# EAGLE board csa_cpu_v2.0j (EAGLE 4.15)
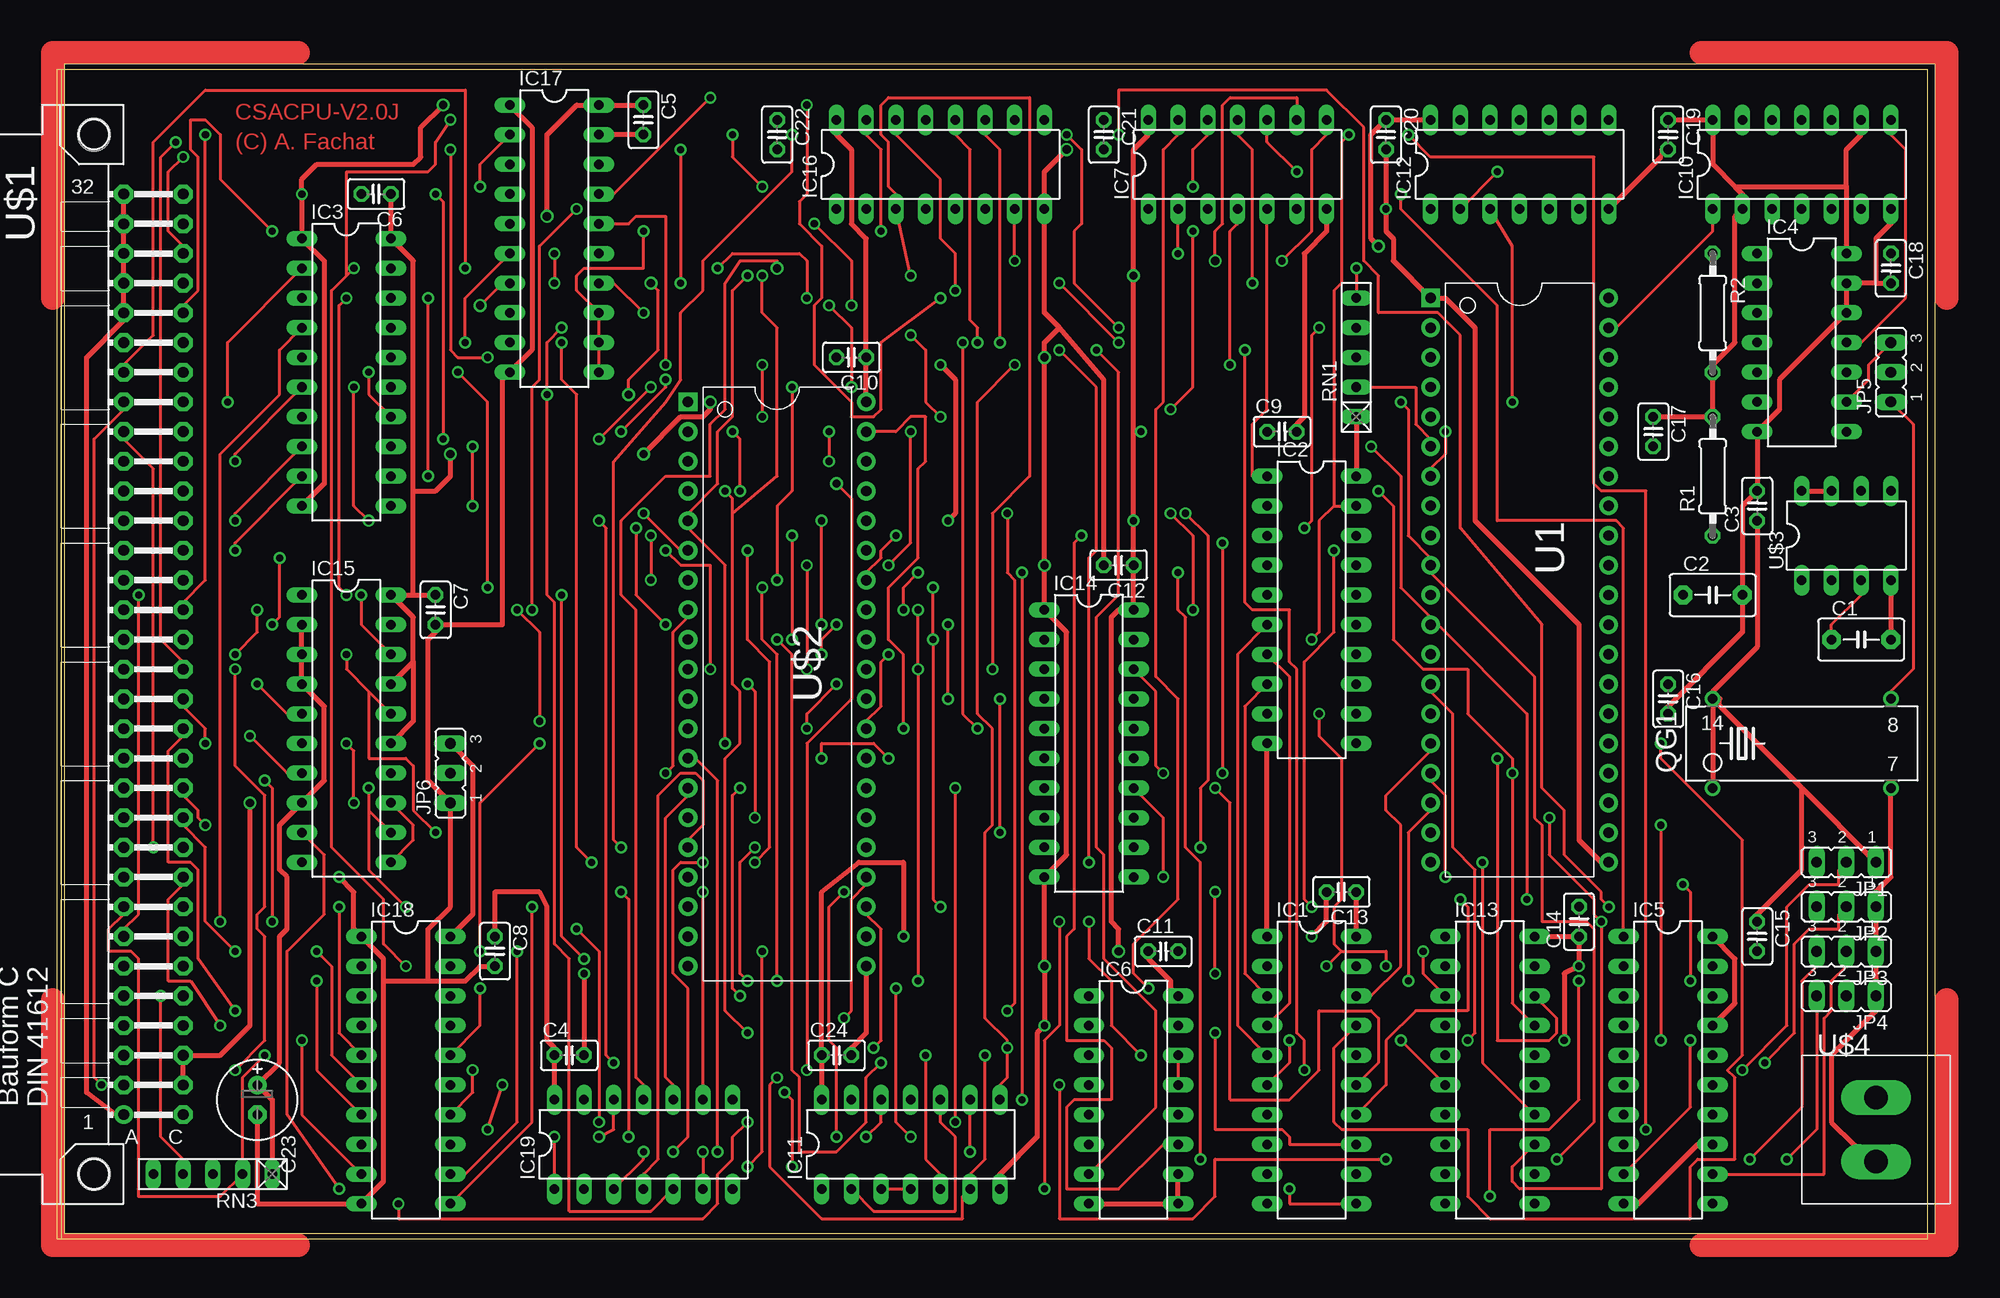
[diagram p2: board, top side]
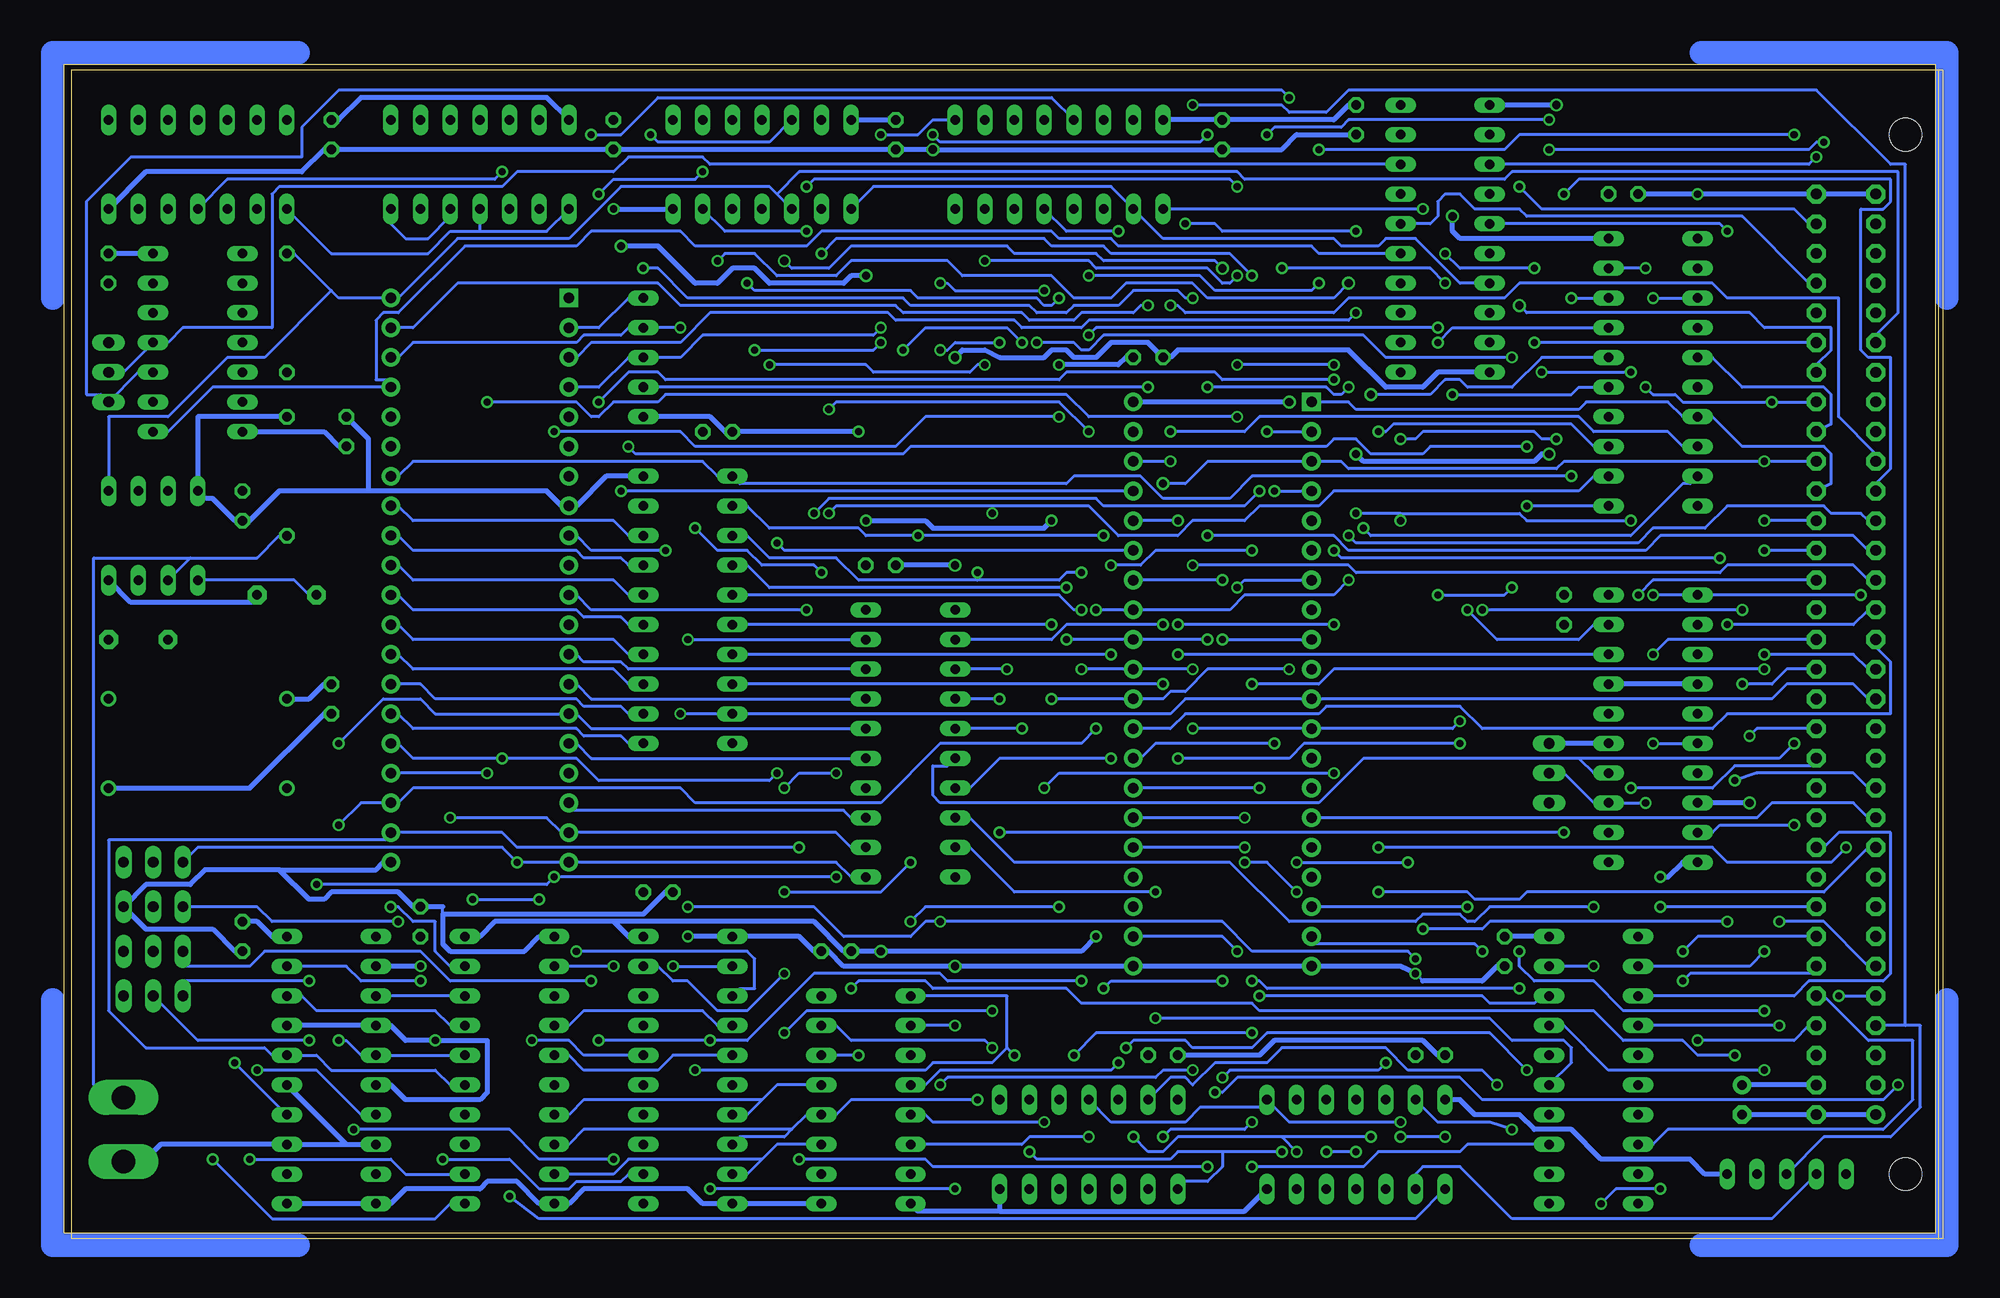
[diagram p3: board, bottom side, seen from below]

Size 160.63 x 100.48 mm. Coordinates in mm from the lower left corner, seen from the top.
Outline: 0,0.01 160,0.01 160,100.01 0,100.01 0,0.01
Outline: 0.63,0.48 160.63,0.48 160.63,100.48 0.63,100.48 0.63,0.48
Copper layers (1*16): Top 0.035mm / dielectric 1.5mm / Bottom 0.035mm
Design rules "default": minimum track width 10mil, minimum drill 24mil, track to track 8mil, track to pad 8mil, pad to pad 8mil, via to via 8mil, smd to smd 8mil, copper to edge 40mil, drill to drill 8mil, minimum pad ring 10mil, minimum via ring 8mil, stop-mask expansion 4mil, vias tented up to drill 0mil, thermal gap 10mil

## Footprints (pad centres in the part's own frame; a part is rotated, then mirrored left to right if it is on the bottom)
C5B3.5 = drill 0.813 pad 1.6 octagon: 1 -2.54,0; 2 2.54,0
C025-025X050 = drill 0.813 octagon: 1 -1.27,0; 2 1.27,0
E2,5-7 = drill 0.813 pad 1.6 round: + -1.27,0 | drill 0.813 pad 1.6 octagon: - 1.27,0
DIL20 = drill 0.813 long: 1 -11.43,-3.81; 2 -8.89,-3.81; 3 -6.35,-3.81; 4 -3.81,-3.81; 5 -1.27,-3.81; 6 1.27,-3.81; 7 3.81,-3.81; 8 6.35,-3.81; 9 8.89,-3.81; 10 11.43,-3.81; 11 11.43,3.81; 12 8.89,3.81; 13 6.35,3.81; 14 3.81,3.81; 15 1.27,3.81; 16 -1.27,3.81; 17 -3.81,3.81; 18 -6.35,3.81; 19 -8.89,3.81; 20 -11.43,3.81
DIL14 = drill 0.813 long: 1 -7.62,-3.81; 2 -5.08,-3.81; 3 -2.54,-3.81; 4 0,-3.81; 5 2.54,-3.81; 6 5.08,-3.81; 7 7.62,-3.81; 8 7.62,3.81; 9 5.08,3.81; 10 2.54,3.81; 11 0,3.81; 12 -2.54,3.81; 13 -5.08,3.81; 14 -7.62,3.81
DIL16 = drill 0.813 long: 1 -8.89,-3.81; 2 -6.35,-3.81; 3 -3.81,-3.81; 4 -1.27,-3.81; 5 1.27,-3.81; 6 3.81,-3.81; 7 6.35,-3.81; 8 8.89,-3.81; 9 8.89,3.81; 10 6.35,3.81; 11 3.81,3.81; 12 1.27,3.81; 13 -1.27,3.81; 14 -3.81,3.81; 15 -6.35,3.81; 16 -8.89,3.81
JP2 = drill 0.914 long: 1 -2.54,0; 2 0,0; 3 2.54,0
SG51 = drill 0.813 round: 1 -7.62,-3.81; 7 7.62,-3.81; 8 7.62,3.81; 14 -7.62,3.81
0207/10 = drill 0.813 octagon: 1 -5.08,0; 2 5.08,0
RN-5 = drill 0.813 long: 1 -5.08,0; 2 -2.54,0; 3 0,0; 4 2.54,0; 5 5.08,0
DIP-40 = drill 0.889 pad 1.6 square: 1 -22.86,-7.62 | drill 0.889 pad 1.6 round: 2 -20.32,-7.62; 3 -17.78,-7.62; 4 -15.24,-7.62; 5 -12.7,-7.62; 6 -10.16,-7.62; 7 -7.62,-7.62; 8 -5.08,-7.62; 9 -2.54,-7.62; 10 0,-7.62; 11 2.54,-7.62; 12 5.08,-7.62; 13 7.62,-7.62; 14 10.16,-7.62; 15 12.7,-7.62; 16 15.24,-7.62; 17 17.78,-7.62; 18 20.32,-7.62; 19 22.86,-7.62; 20 25.4,-7.62; 21 25.4,7.62; 22 22.86,7.62; 23 20.32,7.62; 24 17.78,7.62; 25 15.24,7.62; 26 12.7,7.62; 27 10.16,7.62; 28 7.62,7.62; 29 5.08,7.62; 30 2.54,7.62; 31 0,7.62; 32 -2.54,7.62; 33 -5.08,7.62; 34 -7.62,7.62; 35 -10.16,7.62; 36 -12.7,7.62; 37 -15.24,7.62; 38 -17.78,7.62; 39 -20.32,7.62; 40 -22.86,7.62
CSABUS = drill 0.914 pad 1.6 round: A1 7.62,36.83 | drill 0.914 pad 1.6 octagon: A2 7.62,34.29; A3 7.62,31.75; A4 7.62,29.21; A5 7.62,26.67; A6 7.62,24.13; A7 7.62,21.59; A8 7.62,19.05; A9 7.62,16.51; A10 7.62,13.97; A11 7.62,11.43; A12 7.62,8.89; A13 7.62,6.35; A14 7.62,3.81; A15 7.62,1.27; A16 7.62,-1.27; A17 7.62,-3.81; A18 7.62,-6.35; A19 7.62,-8.89; A20 7.62,-11.43; A21 7.62,-13.97; A22 7.62,-16.51; A23 7.62,-19.05; A24 7.62,-21.59; A25 7.62,-24.13; A26 7.62,-26.67; A27 7.62,-29.21; A28 7.62,-31.75; A29 7.62,-34.29; A30 7.62,-36.83; A31 7.62,-39.37; A32 7.62,-41.91; C1 2.54,36.83; C2 2.54,34.29; C3 2.54,31.75; C4 2.54,29.21; C5 2.54,26.67; C6 2.54,24.13; C7 2.54,21.59; C8 2.54,19.05; C9 2.54,16.51; C10 2.54,13.97; C11 2.54,11.43; C12 2.54,8.89; C13 2.54,6.35; C14 2.54,3.81; C15 2.54,1.27; C16 2.54,-1.27; C17 2.54,-3.81; C18 2.54,-6.35; C19 2.54,-8.89; C20 2.54,-11.43; C21 2.54,-13.97; C22 2.54,-16.51; C23 2.54,-19.05; C24 2.54,-21.59; C25 2.54,-24.13; C26 2.54,-26.67; C27 2.54,-29.21; C28 2.54,-31.75; C29 2.54,-34.29; C30 2.54,-36.83; C31 2.54,-39.37; C32 2.54,-41.91 | hole 2.794: 10.16,41.91; 10.16,-46.99
DIP40 = drill 0.889 pad 1.6 square: 1 -24.13,-7.62 | drill 0.889 pad 1.6 round: 2 -21.59,-7.62; 3 -19.05,-7.62; 4 -16.51,-7.62; 5 -13.97,-7.62; 6 -11.43,-7.62; 7 -8.89,-7.62; 8 -6.35,-7.62; 9 -3.81,-7.62; 10 -1.27,-7.62; 11 1.27,-7.62; 12 3.81,-7.62; 13 6.35,-7.62; 14 8.89,-7.62; 15 11.43,-7.62; 16 13.97,-7.62; 17 16.51,-7.62; 18 19.05,-7.62; 19 21.59,-7.62; 20 24.13,-7.62; 21 24.13,7.62; 22 21.59,7.62; 23 19.05,7.62; 24 16.51,7.62; 25 13.97,7.62; 26 11.43,7.62; 27 8.89,7.62; 28 6.35,7.62; 29 3.81,7.62; 30 1.27,7.62; 31 -1.27,7.62; 32 -3.81,7.62; 33 -6.35,7.62; 34 -8.89,7.62; 35 -11.43,7.62; 36 -13.97,7.62; 37 -16.51,7.62; 38 -19.05,7.62; 39 -21.59,7.62; 40 -24.13,7.62
DIL08@1 = drill 0.813 long: 1 -11.43,-2.54; 2 -8.89,-2.54; 3 -6.35,-2.54; 4 -3.81,-2.54; 5 -3.81,5.08; 6 -6.35,5.08; 7 -8.89,5.08; 8 -11.43,5.08
TASTER = drill 2.007 long: 1 0,4.013; 3 0,-1.473

## Placement (x,y rotation side)
C1  100n  [C5B3.5]  154.3,51.28 0 top
C2  100n  [C5B3.5]  141.6,55.09 0 top
C3  100n  [C025-025X050]  145.41,62.71 90 top
C4  100n  [C025-025X050]  43.81,15.72 0 top
C5  100n  [C025-025X050]  50.16,95.73 270 top
C6  100n  [C025-025X050]  27.3,89.38 180 top
C7  100n  [C025-025X050]  32.38,53.82 270 top
C8  100n  [C025-025X050]  37.46,24.61 270 top
C9  100n  [C025-025X050]  104.77,69.06 0 top
C10  100n  [C025-025X050]  67.94,75.41 180 top
C11  100n  [C025-025X050]  94.61,24.61 0 top
C12  100n  [C025-025X050]  90.8,57.63 180 top
C13  100n  [C025-025X050]  109.85,29.69 180 top
C14  100n  [C025-025X050]  130.17,27.15 90 top
C15  100n  [C025-025X050]  145.41,25.88 270 top
C16  100n  [C025-025X050]  137.79,46.2 270 top
C17  100n  [C025-025X050]  136.52,69.06 270 top
C18  100n  [C025-025X050]  156.84,83.03 270 top
C19  100n  [C025-025X050]  137.79,94.46 270 top
C20  100n  [C025-025X050]  113.66,94.46 270 top
C21  100n  [C025-025X050]  89.53,94.46 270 top
C22  100n  [C025-025X050]  61.59,94.46 270 top
C23  47u  [E2,5-7]  17.14,11.91 270 top
C24  100n  [C025-025X050]  66.67,15.72 0 top
IC1  74LS245N  [DIL20]  107.31,14.45 270 top
IC2  74LS245N  [DIL20]  107.31,53.82 270 top
IC3  74LS245N  [DIL20]  24.76,74.14 270 top
IC4  74LS293N  [DIL14]  149.22,76.68 270 top
IC5  74LS688N  [DIL20]  137.79,14.45 270 top
IC6  74LS173N  [DIL16]  92.07,11.91 270 top
IC7  74LS14N  [DIL14]  100.96,91.92 0 top
IC10  74LS164N  [DIL14]  149.22,91.92 0 top
IC11  74LS02N  [DIL14]  73.02,8.1 0 top
IC12  74LS86N  [DIL14]  125.09,91.92 0 top
IC13  74LS245N  [DIL20]  122.55,14.45 270 top
IC14  74LS245N  [DIL20]  88.26,42.39 270 top
IC15  74LS688N  [DIL20]  24.76,43.66 270 top
IC16  74LS139N  [DIL16]  75.56,91.92 0 top
IC17  74LS245N  [DIL20]  42.54,85.57 270 top
IC18  74LS245N  [DIL20]  29.84,14.45 270 top
IC19  74ALS08N  [DIL14]  50.16,8.1 0 top
JP1  [JP2]  153.03,32.23 180 top
JP2  [JP2]  153.03,28.42 180 top
JP3  [JP2]  153.03,24.61 180 top
JP4  [JP2]  153.03,20.8 180 top
JP5  [JP2]  156.84,74.14 90 top
JP6  [JP2]  33.65,39.85 90 top
QG1  16MHz  [SG51]  149.22,42.39 0 top
R1  10k  [0207/10]  141.6,65.25 90 top
R2  4k7  [0207/10]  141.6,79.22 270 top
RN1  4k7  [RN-5]  111.12,75.41 90 top
RN3  4k7  [RN-5]  13.33,5.56 180 top
U1  [DIP-40]  125.09,57.63 270 top
U$1  CSABUS  [CSABUS]  13.33,47.47 180 top
U$2  LS610SMALLPADS  [DIP40]  61.59,47.47 270 top
U$3  TL7705  [DIL08@1]  160.65,58.9 0 top
U$4  TASTER  [TASTER]  155.57,8.1 0 top

## Tracks (layer width: path | path; a pad name or v marks a point on that pad's centre or on a via)
8PHI2
  Top 0.254: IC10.8 156.84,94.46 158.11,93.19 158.11,80.49 154.3,76.68 IC4.11
  Bottom 0.254: IC17.18 105.41,91.92 106.04,92.56 112.39,92.56 113.66,91.29 121.91,91.29 123.19,90.02 142.23,90.02 142.87,89.38 142.87,77.95 150.49,77.95 151.76,76.68 IC4.11 155.57,74.14 JP5.2
16M  (via drill 0.61)
  Top 0.254: v55.88,97.64 47.62,89.38 IC17.17 | QG1.8 156.84,46.84 158.75,48.74 158.75,69.7 JP5.1
  Bottom 0.254: v55.88,97.64 56.51,98.27 137.16,98.27 140.33,95.1 140.33,92.56 154.94,92.56 158.75,88.75 158.75,72.24 157.47,72.24 JP5.1 154.3,74.14 IC4.10
/BE  (via drill 0.61)
  Top 0.254: U$1.A8 5.71,27.79 4.44,26.52 4.44,24.61 6.34,24.61 6.98,23.98 6.98,3.66 13.97,3.66 RN3.2 15.87,13.82 v17.77,15.72 | v93.34,21.44 92.07,22.71 92.07,25.25 95.88,29.06 95.88,46.2 93.97,48.11 93.97,70.97 94.61,71.6 94.61,93.19 95.88,94.46 IC7.13
  Bottom 0.254: v93.34,21.44 92.7,22.07 86.99,22.07 86.35,21.44 74.92,21.44 73.66,20.17 59.05,20.17 58.41,19.53 29.84,19.53 27.3,16.99 22.22,16.99 20.95,15.72 v17.77,15.72
/BEXTIO  (via drill 0.61)
  Top 0.254: v8.89,20.8 8.89,8.74 10.79,6.83 RN3.4
  Bottom 0.254: v8.89,20.8 U$1.A5 | RN3.4 14.6,1.75 31.11,1.75 36.83,1.75 41.27,6.2 44.45,6.2 45.08,5.56 IC19.2
/BIOINH  (via drill 0.61)
  Top 0.254: v102.23,81.76 102.23,93.19 100.96,94.46 IC7.11 | v75.56,80.49 70.48,76.68 70.48,70.97 69.84,70.33 67.94,70.33 67.94,71.6 64.77,74.78 64.77,79.86 65.4,80.49 65.4,84.94 63.5,86.84 63.5,88.75 64.13,89.38 v64.13,97
  Bottom 0.254: 3.17,18.26 1.9,18.26 1.9,11.28 4.44,8.74 10.16,8.74 RN3.3 | 3.17,18.26 U$1.A4 | v102.23,81.76 101.59,81.13 88.26,81.13 87.62,80.49 77.46,80.49 76.83,79.86 76.19,79.86 v75.56,80.49 | v64.13,97 56.51,97 55.88,96.37 52.7,96.37 50.8,98.27 10.79,98.27 4.44,91.92 3.17,91.92 3.17,18.26
/BIOSEL  (via drill 0.61)
  Top 0.254: v6.98,55.09 6.98,27.79 5.71,26.52 U$1.A7 | v24.76,80.49 24.12,79.86 24.12,55.73 v24.76,55.09
  Bottom 0.254: v6.98,55.09 IC15.1 v24.76,55.09 | v24.76,80.49 IC3.3
/BMEMSEL  (via drill 0.61)
  Top 0.254: v13.97,27.15 13.97,67.16 19.04,72.24 19.04,76.05 IC3.4
  Bottom 0.254: v13.97,27.15 10.16,27.15 6.34,23.34 U$1.A6
/BUSEN  (via drill 0.61)
  Top 0.254: v107.31,51.28 107.94,51.92 107.94,61.44 109.21,62.71 | 109.21,62.71 IC2.19 | v110.48,94.46 109.85,93.83 109.85,81.76 109.21,81.13 109.21,62.71 | v29.84,23.34 27.93,25.25 27.93,29.06 23.49,33.5 23.49,81.13 24.76,82.4 | 24.76,82.4 v25.39,83.03 | v97.15,90.02 97.15,93.19 98.42,94.46 IC7.12 | v60.32,90.02 57.78,92.56 v57.78,94.46 | v33.65,95.73 32.38,93.83 32.38,91.92 31.74,91.29 24.76,91.29 24.76,82.4
  Bottom 0.254: v107.31,51.28 IC14.19 | v110.48,94.46 109.85,93.83 100.32,93.83 IC7.12 | v29.84,23.34 IC18.19 | v25.39,83.03 IC3.19 | v97.15,90.02 96.52,90.65 60.96,90.65 v60.32,90.02 | v57.78,94.46 57.15,95.1 51.43,95.1 50.8,95.73 v33.65,95.73
/IOSEL  (via drill 0.61)
  Top 0.254: v50.16,7.47 50.16,6.83 IC19.3 | v52.7,7.47 53.97,8.74 53.97,21.44 52.7,22.71 52.7,31.6 53.34,32.23 v55.24,32.23 | v45.72,32.23 44.45,33.5 44.45,72.24 43.18,73.51 v43.18,76.68
  Bottom 0.254: v50.16,7.47 v52.7,7.47 | v55.24,32.23 v45.72,32.23 | v43.18,76.68 41.91,77.95 IC3.17
/IRQ  (via drill 0.61)
  Top 0.254: v8.25,33.5 8.25,65.89 5.71,68.43 U$1.A24 | v48.26,33.5 47.62,34.14 47.62,66.52 52.07,71.6 53.34,73.51 53.34,79.22 55.24,81.13 55.24,83.67 62.86,91.29 v62.86,94.46 | v86.35,94.46 87.62,93.19 87.62,86.84 86.99,86.21 86.99,81.76 v90.8,77.95
  Bottom 0.254: U1.4 114.93,72.87 112.39,75.41 RN1.3 107.94,75.41 106.04,77.32 91.44,77.32 v90.8,77.95 | v8.25,33.5 9.52,32.23 18.41,32.23 19.68,33.5 v48.26,33.5 | v62.86,94.46 63.5,93.83 85.72,93.83 v86.35,94.46
/MMUCS  (via drill 0.61)
  Top 0.254: v74.29,15.72 74.29,6.83 75.56,5.56 IC11.5 | v59.05,17.63 57.15,19.53 57.15,41.12 58.41,42.39 58.41,46.84 57.78,47.47 57.78,62.08 | 57.78,62.08 57.78,63.35 v57.15,63.98 | v60.32,82.4 60.32,79.22 61.59,77.95 61.59,65.25 57.78,62.08 | v81.91,83.67 IC16.7
  Bottom 0.254: v74.29,15.72 72.38,17.63 v59.05,17.63 | v57.15,63.98 U$2.4 | v81.91,83.67 73.02,83.67 72.38,83.03 62.86,83.03 61.59,81.76 60.96,81.76 v60.32,82.4
/MMUSTROBE  (via drill 0.61)
  Top 0.254: v59.05,82.4 57.78,81.13 57.78,70.33 56.51,69.06 56.51,64.62 53.97,62.08 U$2.5 53.97,60.81 57.15,57.63 v57.15,42.39 | v95.88,84.3 IC7.2
  Bottom 0.254: v95.88,84.3 94.61,85.57 76.83,85.57 76.19,84.94 71.75,84.94 71.11,84.3 60.96,84.3 v59.05,82.4 | v57.15,42.39 67.3,42.39 68.57,41.12 U$2.28
/NMI  (via drill 0.61)
  Top 0.254: RN1.2 116.2,72.87 116.2,69.7 117.47,68.43 U1.6 | v66.03,79.86 67.94,77.95 v67.94,72.87
  Bottom 0.254: v66.03,79.86 65.4,79.86 64.77,79.22 52.07,79.22 50.8,80.49 37.46,80.49 36.19,81.76 19.68,81.76 18.41,80.49 8.89,80.49 8.89,70.33 5.71,67.16 U$1.A23 | v67.94,72.87 RN1.2
/PMEMSEL  (via drill 0.61, 0.7)
  Top 0.254: v104.77,83.67 107.31,86.21 107.31,93.19 108.58,94.46 IC7.8 | v48.89,72.24 48.89,73.51 51.43,76.05 51.43,81.13 v50.8,81.76
  Bottom 0.254: v104.77,83.67 104.13,84.3 101.59,84.3 99.69,82.4 94.61,82.4 93.34,83.67 85.08,83.67 83.81,82.4 76.19,82.4 74.29,80.49 71.11,80.49 69.84,81.76 64.13,81.76 62.86,80.49 52.07,80.49 v50.8,81.76 | IC3.16 34.29,75.41 36.83,72.87 40.64,72.87 41.27,73.51 42.54,73.51 43.81,72.24 v48.89,72.24
/RES
  Bottom 0.254: 99.69,89.38 100.32,90.02 113.02,90.02 117.47,85.57 126.99,85.57 132.07,80.49 U1.40 137.16,80.49 137.79,81.13 | 99.69,89.38 IC7.3 | 137.79,81.13 140.97,84.3 R2.1 | 137.79,81.13 143.5,75.41 146.68,75.41 151.76,70.33 156.84,70.33 U$3.5 | 99.69,89.38 97.78,91.29 60.32,91.29 59.69,90.65 37.46,90.65 36.83,91.29 3.8,91.29 3.8,79.22 5.71,77.32 U$1.A27
/SO  (via drill 0.61)
  Top 0.254: v3.8,13.18 3.17,13.82 3.17,68.43 5.71,70.97 U$1.A25 | v62.23,12.55 62.86,11.91 v62.86,6.2 | v97.78,6.83 97.78,32.23 96.52,33.5 96.52,53.19 95.88,53.82 v95.88,57 | v106.67,60.81 107.31,61.44 107.31,77.32 v107.94,77.95
  Bottom 0.254: U1.38 132.07,75.41 130.81,76.68 116.83,76.68 116.2,77.32 113.02,77.32 112.39,77.95 RN1.4 v107.94,77.95 | v3.8,13.18 5.08,11.91 39.37,11.91 41.27,13.82 60.32,13.82 61.59,12.55 v62.23,12.55 | v62.86,6.2 86.35,6.2 86.99,6.83 v97.78,6.83 | v95.88,57 96.52,57.63 100.96,57.63 102.23,58.9 104.77,58.9 v106.67,60.81
A0  (via drill 0.61)
  Top 0.254: v26.66,74.14 26.66,72.24 IC3.14 | v34.29,74.14 36.83,71.6 v36.83,55.73 | v43.18,55.09 43.18,25.88 v45.08,23.98 | v107.31,28.42 106.67,29.06 106.67,49.38 109.21,51.92 v109.21,58.9 | v105.41,4.29 105.41,3.02 IC1.11 | v84.45,4.29 84.45,16.99 85.72,18.26 v85.72,27.15
  Bottom 0.254: v34.29,74.14 v26.66,74.14 | v36.83,55.73 37.46,55.09 v43.18,55.09 | v45.08,23.98 45.72,24.61 59.05,24.61 61.59,27.15 v85.72,27.15 86.99,27.15 88.26,25.88 93.97,25.88 96.52,28.42 v107.31,28.42 | v109.21,58.9 115.56,58.9 116.83,60.17 U1.9 | v84.45,4.29 v105.41,4.29
A1  (via drill 0.61)
  Top 0.254: v48.26,69.06 52.07,72.87 v52.07,73.51 | v114.93,71.6 115.56,70.97 115.56,60.17 117.47,58.27 U1.10 117.47,57 126.36,48.11 126.36,36.04 126.99,35.41 126.99,27.15 130.81,27.15 131.44,26.52 131.44,10.01 v128.27,6.83
  Bottom 0.254: v48.26,69.06 47.62,69.06 46.98,69.7 31.74,69.7 29.84,67.79 IC3.13 | v52.07,73.51 61.59,73.51 62.23,74.14 74.92,74.14 75.56,73.51 109.21,73.51 109.85,74.14 112.39,74.14 v114.93,71.6 | v128.27,6.83 122.55,6.83 120.01,4.29 117.47,4.29 116.83,4.93 113.02,4.93 112.39,5.56 IC1.12
A2  (via drill 0.61)
  Top 0.254: v95.24,62.08 97.15,60.17 v97.15,53.82 | v99.05,17.63 99.05,9.37 104.77,9.37 105.41,8.74 105.41,8.1 IC1.13 | v81.27,19.53 81.91,20.17 81.91,56.36 81.27,57 v81.27,62.08
  Bottom 0.254: 81.27,62.71 94.61,62.71 v95.24,62.08 | 81.27,62.71 73.02,62.71 70.48,60.17 65.4,60.17 64.13,61.44 59.69,61.44 58.41,62.71 53.34,62.71 52.07,63.98 31.11,63.98 29.84,65.25 IC3.12 | v97.15,53.82 115.56,53.82 116.83,55.09 U1.11 | v99.05,17.63 97.15,19.53 v81.27,19.53 | 81.27,62.71 v81.27,62.08
A3  (via drill 0.61)
  Top 0.254: v35.55,62.71 v35.55,67.79 | v112.39,67.79 114.93,65.25 114.93,55.73 117.47,53.19 U1.12 118.1,52.55 125.72,44.93 v125.72,29.06 | v120.01,29.06 120.64,28.42 120.64,19.53 116.2,19.53 113.66,16.99 113.66,13.18 IC1.14
  Bottom 0.254: v35.55,67.79 43.81,67.79 44.45,67.16 48.89,67.16 50.16,68.43 52.07,68.43 52.7,67.79 88.26,67.79 88.89,67.16 111.75,67.16 v112.39,67.79 | IC3.11 v35.55,62.71 | v125.72,29.06 v120.01,29.06
A4  (via drill 0.61)
  Top 0.254: v99.05,38.58 100.32,37.31 100.32,11.91 105.41,11.91 107.94,14.45 107.94,19.53 112.39,19.53 113.02,18.9 113.02,15.09 IC1.15 | v94.61,39.85 93.97,40.49 93.97,46.84 IC14.18
  Bottom 0.254: v99.05,38.58 97.78,39.85 v94.61,39.85 | U1.13 116.83,50.01 116.2,49.38 113.02,49.38 112.39,48.74 IC14.18
A5  (via drill 0.61)
  Top 0.254: v120.64,16.99 121.28,17.63 121.28,31.6 119.38,33.5 119.38,44.93 117.47,46.84 U1.14
  Bottom 0.254: v120.64,16.99 117.47,16.99 116.2,15.72 IC1.16 | IC14.17 115.56,46.2 116.83,47.47 U1.14
A6  (via drill 0.61)
  Top 0.254: v137.16,42.39 137.16,41.12 144.14,34.14 144.14,15.72 142.87,14.45 143.5,13.82 143.5,6.83 140.33,6.83 139.69,6.2 139.69,1.75 122.55,1.75 120.64,3.66 120.64,9.37 109.85,9.37 109.21,10.01 109.21,16.36 IC1.17
  Bottom 0.254: IC14.16 115.56,43.66 116.83,44.93 U1.15 128.9,44.93 130.17,46.2 133.34,46.2 v137.16,42.39
A7
  Top 0.254: IC1.18 112.39,20.8 114.93,23.34 114.93,35.41 113.66,36.68 113.66,37.95 117.47,41.76 U1.16
  Bottom 0.254: IC14.15 115.56,41.12 116.83,42.39 U1.16
A8  (via drill 0.61)
  Top 0.254: v94.61,30.96 94.61,36.04 IC14.14 | v118.74,30.96 118.74,37.95 117.47,39.22 U1.17 | v147.95,6.83 150.49,9.37 JP4.3 | v139.06,30.33 139.69,29.69 v139.69,22.07
  Bottom 0.254: v94.61,30.96 v118.74,30.96 119.38,30.33 v139.06,30.33 | v147.95,6.83 142.87,1.75 128.9,1.75 127.63,3.02 IC13.11 | v139.69,22.07 150.49,22.07 JP4.3
A9  (via drill 0.61)
  Top 0.254: v144.78,6.83 149.22,11.28 149.22,22.07 150.49,23.34 JP3.3 | v115.56,22.07 115.56,34.77 117.47,36.68 U1.18
  Bottom 0.254: IC14.13 93.34,36.04 93.97,36.68 117.47,36.68 U1.18 | v144.78,6.83 132.71,6.83 131.44,5.56 IC13.12 | v115.56,22.07 127.63,22.07 130.17,24.61 143.5,24.61 144.78,23.34 150.49,23.34 JP3.3
A10  (via drill 0.61)
  Top 0.254: IC13.13 124.45,6.2 124.45,4.93 125.09,4.29 132.07,4.29 v132.07,27.15 131.44,27.79 131.44,29.06 127.63,32.87 v127.63,36.04
  Bottom 0.254: IC14.12 93.34,33.5 94.61,34.77 U1.19 118.1,34.77 119.38,36.04 v127.63,36.04 | v132.07,27.15 142.87,27.15 144.14,28.42 JP2.3
A11  (via drill 0.61)
  Top 0.254: v121.91,32.23 121.91,15.09 IC13.14
  Bottom 0.254: IC14.11 93.34,30.96 94.61,32.23 U1.20 v121.91,32.23 123.19,33.5 149.22,33.5 JP1.3
B2PHI2  (via drill 0.61)
  Top 0.254: v52.07,74.78 52.07,87.48 49.53,87.48 48.89,86.84 IC17.16 | v60.32,74.78 v60.32,70.33 | v124.45,71.6 124.45,84.94 IC12.3
  Bottom 0.254: U$1.C29 11.43,81.76 17.14,87.48 35.55,87.48 36.19,88.11 40,88.11 41.27,89.38 42.54,89.38 43.18,88.75 43.18,87.48 43.81,86.84 IC17.16 | v52.07,74.78 v60.32,74.78 | v60.32,70.33 73.02,70.33 74.92,72.24 109.21,72.24 109.85,71.6 113.66,71.6 114.93,70.33 115.56,70.33 116.83,71.6 v124.45,71.6
B8PHI2  (via drill 0.61)
  Top 0.254: v36.19,90.02 36.19,91.92 IC17.2
  Bottom 0.254: v36.19,90.02 34.29,88.11 12.7,88.11 11.43,86.84 U$1.C31
B16M  (via drill 0.61)
  Top 0.254: v10.79,92.56 9.52,91.29 9.52,86.21 10.79,84.94 U$1.C30
  Bottom 0.254: v10.79,92.56 11.43,91.92 IC17.3
BPHI0  (via drill 0.61)
  Top 0.254: v18.41,86.21 13.97,90.65 13.97,94.46 12.7,95.73 11.43,95.73 11.43,93.19 12.06,92.56 12.06,81.13 10.79,79.86 U$1.C28
  Bottom 0.254: v18.41,86.21 19.04,86.84 IC17.5
BPHI1  (via drill 0.61)
  Top 0.254: v34.92,76.68 34.92,80.49 IC17.6
  Bottom 0.254: U$1.C27 v34.92,76.68
BPHI2  (via drill 0.7)
  Top 0.254: v36.19,79.86 38.1,81.76 IC17.7
  Bottom 0.254: IC7.1 91.44,90.02 71.11,90.02 IC16.2 66.67,85.57 52.07,85.57 51.43,84.94 48.26,84.94 47.62,85.57 45.08,85.57 41.27,81.76 IC17.7 | U$1.C26 10.79,74.78 9.52,76.05 9.52,77.95 15.24,77.95 16.5,79.22 35.55,79.22 v36.19,79.86
BR/W  (via drill 0.61)
  Top 0.254: v14.6,71.6 14.6,76.68 IC3.2 | v50.16,62.08 53.34,58.9 U$2.6 | v26.66,61.44 25.39,62.71 v25.39,72.87 | v76.83,81.13 76.83,84.3 75.56,85.57 75.56,90.65 71.75,94.46 IC16.14 | v90.8,76.68 v85.72,81.76 | v101.59,76.05 101.59,54.46 102.23,53.82 105.41,53.82 105.41,49.38 106.04,48.74 106.04,17.63 106.67,16.99 v106.67,14.45 | v79.37,15.72 79.37,6.83 78.1,5.56 IC11.6 77.46,3.66 77.46,1.75 65.4,1.75 60.96,6.2 60.96,13.18 v61.59,13.82 | v46.35,61.44 46.98,60.81 46.98,15.72 v47.62,15.09
  Bottom 0.254: U$1.C25 v14.6,71.6 22.22,71.6 22.86,72.24 24.76,72.24 v25.39,72.87 | 46.35,62.08 36.19,62.08 35.55,61.44 v26.66,61.44 | 46.35,62.08 v50.16,62.08 | v85.72,81.76 85.08,81.76 84.45,81.13 v76.83,81.13 | v90.8,76.68 91.44,76.05 v101.59,76.05 | v106.67,14.45 86.99,14.45 86.35,15.09 81.27,15.09 80,16.36 | 80,16.36 80,20.8 IC6.1 | v79.37,15.72 80,16.36 | v46.35,61.44 46.35,62.08 | v47.62,15.09 48.26,14.45 60.96,14.45 v61.59,13.82
BSYNC
  Bottom 0.254: U$1.C24 9.52,69.7 9.52,72.24 10.16,72.87 17.14,72.87 19.68,75.41 IC3.5
BUSA0  (via drill 0.61, 0.7)
  Top 0.254: v15.24,66.52 15.24,67.16 IC3.6 | v115.56,94.46 117.47,92.56 131.44,92.56 131.44,64.62 132.07,63.98 135.88,63.98 v135.88,9.37 | v113.66,6.83 99.05,6.83 99.05,3.66 97.15,1.75 85.72,1.75 v85.72,13.18 | v64.13,14.45 64.13,42.39 67.94,46.2 67.94,63.35 v66.67,64.62
  Bottom 0.254: U$1.C23 v15.24,66.52 32.38,66.52 33.02,65.89 50.8,65.89 51.43,66.52 U$2.3 62.86,66.52 64.77,64.62 v66.67,64.62 | v115.56,94.46 113.02,94.46 109.85,97.64 76.19,97.64 IC16.13 | v135.88,9.37 122.55,9.37 120.01,6.83 v113.66,6.83 | v85.72,13.18 85.08,13.82 67.3,13.82 66.67,14.45 v64.13,14.45
BUSA1
  Bottom 0.254: U$1.C22 9.52,64.62 9.52,67.16 10.16,67.79 17.14,67.79 19.68,70.33 IC3.7 22.22,70.33 23.49,71.6 30.47,71.6 31.11,70.97 50.16,70.97 50.8,71.6 U$2.1
BUSA2  (via drill 0.61)
  Top 0.254: v15.24,61.44 15.24,62.08 IC3.8 | v66.03,69.06 v66.03,66.52
  Bottom 0.254: U$1.C21 v15.24,61.44 | v66.03,69.06 59.69,69.06 58.41,70.33 31.11,70.33 29.84,69.06 23.49,69.06 22.22,67.79 IC3.8 | v66.03,66.52 U$2.38
BUSA3  (via drill 0.61)
  Top 0.254: v15.24,58.9 15.24,59.54 IC3.9 | v65.4,52.55 v65.4,61.44 | v52.07,52.55 49.53,55.09 v49.53,60.81
  Bottom 0.254: U$1.C20 v15.24,58.9 | v52.07,52.55 v65.4,52.55 | v49.53,60.81 48.89,60.17 26.66,60.17 22.22,64.62 21.58,64.62 IC3.9 | v65.4,61.44 U$2.36
BUSA4  (via drill 0.61)
  Top 0.254: v26.03,55.09 26.03,52.55 IC15.18 | v66.67,52.55 65.4,51.28 v65.4,50.01
  Bottom 0.254: v26.03,55.09 24.76,56.36 U$1.C19 | v66.67,52.55 74.92,52.55 76.19,51.28 IC14.2 | IC15.18 v65.4,50.01
BUSA5  (via drill 0.61)
  Top 0.254: v80,48.74 80,62.08 83.18,65.25 83.18,97.64 71.11,97.64 70.48,97 70.48,94.46 71.11,93.83 71.11,90.02 71.75,89.38 IC16.3 v73.02,82.4 | v12.7,94.46 12.7,56.36 10.79,54.46 U$1.C18 | v53.34,93.19 v53.34,81.76
  Bottom 0.254: v80,48.74 IC14.3 | v12.7,94.46 36.19,94.46 37.46,93.19 v53.34,93.19 | v53.34,81.76 53.97,81.13 62.23,81.13 63.5,82.4 v73.02,82.4
BUSA6  (via drill 0.61)
  Top 0.254: 26.66,46.84 24.76,48.74 v24.76,50.01 | 26.66,46.84 IC15.16 | v80.64,34.77 v80.64,46.2 | v32.38,34.77 30.47,36.68 30.47,40.49 29.84,41.12 26.66,41.12 26.66,46.84
  Bottom 0.254: v24.76,50.01 23.49,51.28 U$1.C17 | v32.38,34.77 v80.64,34.77 | v80.64,46.2 IC14.4
BUSA7  (via drill 0.61)
  Top 0.254: v17.14,47.47 19.68,44.93 IC15.5 | v78.73,43.66 77.46,44.93 v77.46,76.68 | v36.83,75.41 34.29,75.41 33.65,76.05 v33.65,93.19 | v10.16,93.83 8.89,92.56 8.89,51.28 10.79,49.38 U$1.C16
  Bottom 0.254: v17.14,47.47 14.6,47.47 13.33,48.74 U$1.C16 | v77.46,76.68 74.29,76.68 73.66,76.05 73.02,76.05 71.75,77.32 49.53,77.32 47.62,75.41 v36.83,75.41 | v33.65,93.19 11.43,93.19 10.79,93.83 v10.16,93.83 | v78.73,43.66 IC14.5
BUSA8  (via drill 0.61)
  Top 0.254: v12.7,42.39 12.7,43.66 10.79,45.57 U$1.C15
  Bottom 0.254: 31.11,41.12 29.84,39.85 IC15.14 | 31.11,41.12 49.53,41.12 53.34,37.31 85.72,37.31 86.35,37.95 86.35,40.49 85.08,40.49 IC14.6 | v12.7,42.39 13.97,41.12 31.11,41.12
BUSA9  (via drill 0.61)
  Top 0.254: v16.5,43.03 19.68,39.85 IC15.7 | v71.11,41.12 69.84,42.39 65.4,42.39 v65.4,41.12 | v41.27,42.39 36.19,37.31 v36.19,24.61 | v15.24,19.53 12.06,23.98 12.06,31.6 11.43,32.23 9.52,32.23 9.52,41.76 10.79,43.03 U$1.C14
  Bottom 0.254: v16.5,43.03 15.87,43.66 U$1.C14 | v71.11,41.12 80.64,41.12 83.18,38.58 IC14.7 | v65.4,41.12 55.88,41.12 54.61,42.39 v41.27,42.39 | v36.19,24.61 36.19,23.34 34.92,22.07 29.84,22.07 27.3,19.53 v15.24,19.53
BUSA10  (via drill 0.61)
  Top 0.254: v26.66,38.58 26.66,36.68 | 26.66,36.68 IC15.12 | v29.84,28.42 26.66,31.6 26.66,36.68
  Bottom 0.254: v26.66,38.58 19.68,38.58 17.77,40.49 10.79,40.49 U$1.C13 | v29.84,28.42 38.73,28.42 40,27.15 40.64,27.15 41.27,27.79 44.45,27.79 45.08,27.15 55.88,27.15 60.96,32.23 79.37,32.23 83.18,36.04 IC14.8
BUSA11  (via drill 0.61)
  Top 0.254: v12.7,35.41 12.06,36.04 12.06,36.68 10.79,37.95 U$1.C12 | v67.3,29.69 66.03,28.42 66.03,16.99 66.67,16.36 v66.67,8.74 | v59.05,10.01 57.78,8.74 57.78,6.83 56.51,5.56 56.51,3.02 55.24,1.75 29.2,1.75 v29.2,3.02 | v24.12,4.29 19.68,10.64 19.68,24.61 22.86,27.79 22.86,32.87 IC15.9
  Bottom 0.254: v12.7,35.41 19.04,35.41 19.68,34.77 IC15.9 | v67.3,29.69 79.37,29.69 83.18,33.5 IC14.9 | v66.67,8.74 66.03,9.37 59.69,9.37 v59.05,10.01 | v29.2,3.02 27.93,4.29 v24.12,4.29
BUSA12  (via drill 0.61)
  Top 0.254: v15.24,24.61 12.7,27.15 12.7,33.5 10.79,35.41 U$1.C11
  Bottom 0.254: v15.24,24.61 16.5,23.34 IC18.2
BUSA13
  Bottom 0.254: IC18.3 12.7,20.8 11.43,22.07 5.08,22.07 4.44,22.71 4.44,34.77 8.89,34.77 10.16,33.5 U$1.C10
BUSA14  (via drill 0.61)
  Top 0.254: v13.97,18.26 11.43,22.07 9.52,22.07 9.52,29.06 10.79,30.33 U$1.C9
  Bottom 0.254: v13.97,18.26 IC18.4
BUSA15  (via drill 0.61)
  Top 0.254: v24.12,28.42 24.12,17.63 IC18.5
  Bottom 0.254: U$1.C8 v24.12,28.42
BUSA16  (via drill 0.61)
  Top 0.254: v22.22,24.61 23.49,23.34 23.49,15.72 IC18.6
  Bottom 0.254: v22.22,24.61 20.95,25.88 U$1.C7
BUSA17  (via drill 0.61)
  Top 0.254: v22.22,22.07 22.22,14.45 IC18.7
  Bottom 0.254: v22.22,22.07 21.58,22.71 10.79,22.71 U$1.C6
BUSA18
  Bottom 0.254: IC18.8 24.76,8.1 23.49,9.37 5.08,9.37 2.54,11.91 2.54,16.99 6.34,16.99 10.16,20.8 U$1.C5
BUSA19  (via drill 0.61)
  Top 0.254: v20.95,16.99 20.95,10.64 IC18.9
  Bottom 0.254: v20.95,16.99 12.7,16.99 11.43,18.26 U$1.C4
BUSD0  (via drill 0.61)
  Top 0.254: v71.75,60.17 70.48,58.9 70.48,58.27 69.21,57 U$2.34 | v32.38,89.38 33.02,88.75 v33.02,68.43 | v46.35,68.43 v50.8,72.87 | v62.86,72.87 62.86,63.98 61.59,62.71 v61.59,56.36 | v87.62,60.17 86.99,59.54 86.99,26.52 86.35,25.88 86.35,16.99 89.53,16.99 90.16,16.36 90.16,11.91 86.99,11.91 86.35,11.28 86.35,4.29 90.8,4.29 94.61,8.1 IC6.11
  Bottom 0.254: 100.96,6.83 102.23,5.56 IC1.9 | 100.96,6.83 99.69,8.1 IC6.11 | 100.96,6.83 112.39,6.83 113.66,5.56 IC13.9 | v71.75,60.17 v87.62,60.17 92.07,60.17 92.7,60.81 100.32,60.81 102.23,62.71 IC2.2 | v32.38,89.38 31.11,90.65 4.44,90.65 4.44,88.75 5.08,88.11 6.98,88.11 6.98,76.05 6.34,75.41 4.44,75.41 4.44,65.89 5.71,64.62 U$1.A22 | v33.02,68.43 34.29,68.43 34.92,69.06 44.45,69.06 45.08,68.43 v46.35,68.43 | v50.8,72.87 51.43,72.24 52.07,72.24 52.7,72.87 v62.86,72.87 | v61.59,56.36 U$2.34
BUSD1  (via drill 0.61)
  Top 0.254: v73.66,57 72.38,55.73 v72.38,53.82 | v50.8,60.17 v50.8,56.36 | v82.55,57 v82.55,11.91
  Bottom 0.254: 98.42,9.37 99.05,8.74 102.86,8.74 IC1.8 | 98.42,9.37 97.15,10.64 IC6.12 94.61,10.64 93.34,11.91 v82.55,11.91 | 98.42,9.37 116.2,9.37 117.47,8.1 IC13.8 | 82.55,56.36 75.56,56.36 74.92,57 v73.66,57 | 82.55,56.36 92.7,56.36 94.61,58.27 100.32,58.27 102.23,60.17 IC2.3 | v72.38,53.82 U$2.33 60.96,53.82 59.69,55.09 52.07,55.09 v50.8,56.36 | v50.8,60.17 50.16,59.54 26.03,59.54 24.76,60.81 20.31,60.81 18.41,62.71 10.16,62.71 9.52,62.08 6.98,62.08 6.34,61.44 U$1.A21 | 82.55,56.36 v82.55,57
BUSD2  (via drill 0.61)
  Top 0.254: IC6.14 IC6.13 | v74.92,55.73 v74.92,51.28 74.92,29.06 v75.56,28.42 | v62.86,60.17 v62.86,51.28 | v92.7,15.72 90.16,18.26 90.16,22.07 88.26,23.98 v88.26,27.15
  Bottom 0.254: 100.96,11.91 99.69,13.18 IC6.13 | 100.96,11.91 102.23,10.64 IC1.7 | 100.96,11.91 116.2,11.91 117.47,10.64 IC13.7 | v74.92,55.73 100.32,55.73 102.23,57.63 IC2.4 | v74.92,51.28 U$2.32 v62.86,51.28 | v62.86,60.17 52.07,60.17 50.8,58.9 25.39,58.9 24.12,60.17 7.62,60.17 6.34,58.9 U$1.A20 | v88.26,27.15 86.99,28.42 v75.56,28.42 | v92.7,15.72 IC6.14
BUSD3  (via drill 0.61)
  Top 0.254: v105.41,16.99 105.41,15.09 IC1.6 | v114.93,16.99 IC13.6 | v73.66,53.82 v73.66,48.74 v73.66,22.07 | v64.13,57.63 v64.13,48.74
  Bottom 0.254: v114.93,16.99 v105.41,16.99 102.23,16.99 96.52,22.71 85.72,22.71 85.08,22.07 v73.66,22.07 | v73.66,53.82 74.29,53.82 75.56,55.09 IC2.5 | v73.66,48.74 U$2.31 v64.13,48.74 | v64.13,57.63 50.8,57.63 50.16,57 19.04,57 18.41,57.63 7.62,57.63 6.34,56.36 U$1.A19
BUSD4  (via drill 0.61)
  Top 0.254: IC2.6 100.96,50.01 100.96,18.26 IC1.5 | v18.41,52.55 19.04,53.19 v19.04,58.27 | v52.07,58.9 53.34,57.63 55.88,57.63 v55.88,48.74 | v76.19,46.2 v76.19,52.55
  Bottom 0.254: IC1.5 108.58,15.72 109.85,14.45 116.2,14.45 117.47,15.72 IC13.5 | v18.41,52.55 7.62,52.55 6.34,53.82 U$1.A18 | v19.04,58.27 51.43,58.27 v52.07,58.9 | v55.88,48.74 62.86,48.74 64.77,46.84 66.03,46.84 66.67,46.2 U$2.30 v76.19,46.2 | v76.19,52.55 IC2.6
BUSD5  (via drill 0.61)
  Top 0.254: IC2.7 105.41,48.11 105.41,20.17 IC1.4 | v71.11,50.01 70.48,49.38 70.48,45.57 69.21,44.3 U$2.29
  Bottom 0.254: IC1.4 104.77,18.26 106.04,19.53 116.2,19.53 117.47,18.26 IC13.4 | U$1.A17 5.71,50.65 4.44,49.38 4.44,44.93 18.41,44.93 19.68,43.66 39.37,43.66 41.27,45.57 52.7,45.57 53.34,44.93 64.77,44.93 66.03,43.66 U$2.29 | v71.11,50.01 IC2.7
BUSD6  (via drill 0.61)
  Top 0.254: IC1.3 101.59,22.71 101.59,45.57 IC2.8 | v116.83,24.61 116.83,22.71 IC13.3 | v15.24,50.01 17.14,51.92 v17.14,53.82 | v39.37,53.82 41.27,51.92 v41.27,44.3 | v66.67,47.47 64.13,44.93 v64.13,43.66
  Bottom 0.254: v116.83,24.61 102.23,24.61 101.59,23.98 101.59,21.44 102.86,21.44 IC1.3 | v15.24,50.01 7.62,50.01 6.34,48.74 U$1.A16 | v17.14,53.82 v39.37,53.82 | v41.27,44.3 41.91,43.66 U$2.12 v64.13,43.66 | v66.67,47.47 IC2.8
BUSD7  (via drill 0.61)
  Top 0.254: 109.85,24.61 v108.58,23.34 | 109.85,24.61 113.66,24.61 v113.66,23.34 | 109.85,24.61 109.21,25.25 109.21,28.42 109.85,29.06 109.85,41.12 107.94,43.03 v107.94,44.93
  Bottom 0.254: v108.58,23.34 IC1.2 | v113.66,23.34 IC13.2 | U$1.A15 6.34,46.2 7.62,47.47 13.33,47.47 14.6,46.2 U$2.11 64.77,46.2 66.03,44.93 IC2.9 v107.94,44.93
CPUA12  (via drill 0.61)
  Top 0.254: v57.78,69.06 58.41,68.43 v58.41,63.98 | v96.52,62.08 98.42,60.17 98.42,39.22 97.78,38.58 v97.78,33.5
  Bottom 0.254: IC13.15 127.63,13.18 128.9,14.45 137.79,14.45 139.06,15.72 IC5.16 142.87,15.72 143.5,16.36 153.66,16.36 156.84,19.53 156.84,34.14 132.71,34.14 U1.22 123.19,34.77 121.91,33.5 v97.78,33.5 | v58.41,63.98 59.69,62.71 71.75,62.71 72.38,63.35 95.24,63.35 v96.52,62.08 | v57.78,69.06 U$2.2
CPUA13  (via drill 0.61)
  Top 0.254: v72.38,43.66 72.38,50.01 71.11,51.28 71.11,55.73 73.66,58.27 73.66,65.89 74.29,66.52 74.29,70.33 73.02,70.33 71.75,69.06 U$2.39 | v137.16,35.41 v137.16,16.99
  Bottom 0.254: IC13.16 IC5.5 135.25,15.72 136.52,16.99 v137.16,16.99 | v72.38,43.66 73.66,42.39 85.72,42.39 90.8,37.31 106.67,37.31 107.94,38.58 130.81,38.58 132.07,37.31 U1.23 135.25,37.31 v137.16,35.41
CPUA14  (via drill 0.61)
  Top 0.254: v113.02,63.98 114.3,62.71 114.3,51.28 116.83,48.74 120.64,48.74 120.64,44.93 124.45,41.12 v124.45,39.85 124.45,20.17 IC13.17
  Bottom 0.254: IC13.17 127.63,18.26 128.9,19.53 139.06,19.53 140.33,20.8 IC5.18 | U$2.37 v113.02,63.98 | v124.45,39.85 U1.24
CPUA15  (via drill 0.61)
  Top 0.254: v99.69,59.54 v99.69,39.85 | v123.19,41.12 123.19,16.99 127.63,16.99 128.27,17.63 128.27,18.9 IC13.18
  Bottom 0.254: IC13.18 IC5.3 | v99.69,59.54 99.05,58.9 U$2.35 | v99.69,39.85 100.32,39.22 114.93,39.22 116.83,41.12 v123.19,41.12 130.81,41.12 132.07,42.39 U1.25
CPUD0
  Bottom 0.254: IC2.18 112.39,60.17 113.66,61.44 130.81,61.44 132.07,62.71 U1.33
CPUD1
  Bottom 0.254: IC2.17 112.39,57.63 113.02,58.27 116.2,58.27 116.83,58.9 130.81,58.9 132.07,60.17 U1.32
CPUD2
  Bottom 0.254: IC2.16 112.39,55.09 113.66,56.36 130.81,56.36 132.07,57.63 U1.31
CPUD3
  Bottom 0.254: IC2.15 112.39,52.55 113.02,53.19 116.2,53.19 116.83,53.82 130.81,53.82 132.07,55.09 U1.30
CPUD4
  Bottom 0.254: IC2.14 112.39,50.01 113.66,51.28 130.81,51.28 132.07,52.55 U1.29
CPUD5
  Bottom 0.254: IC2.13 112.39,47.47 113.66,48.74 130.81,48.74 132.07,50.01 U1.28
CPUD6
  Bottom 0.254: IC2.12 112.39,44.93 113.02,45.57 116.2,45.57 116.83,46.2 128.9,46.2 130.17,47.47 U1.27
CPUD7
  Bottom 0.254: IC2.11 112.39,42.39 113.02,43.03 116.2,43.03 116.83,43.66 130.81,43.66 132.07,44.93 U1.26
GND  (via drill 0.61, 0.7)
  Top 0.254: 5.71,78.59 U$1.A28 | 137.16,92.56 137.16,93.19 C19.2
  Top 0.406: IC17.1 40.64,95.1 40.64,76.05 IC17.10 38.1,73.51 38.1,52.55 C7.2 32.38,51.92 31.74,51.28 31.74,39.22 JP6.1 33.65,28.42 31.74,26.52 31.74,22.07 | IC1.1 IC2.10 | C24.2 67.94,16.36 69.21,17.63 U$2.21 | v45.08,22.71 C4.2 | IC3.10 22.86,64.62 22.86,83.67 IC3.1 v20.95,89.38 20.95,90.65 22.22,91.92 30.47,91.92 31.11,92.56 31.11,95.1 v33.02,97 | U$1.A28 U$1.A29 U$1.A30 U$1.A31 U$1.A32 | C23.- 17.14,3.02 IC18.10 27.93,4.93 27.93,22.07 | 27.93,22.07 27.93,23.98 IC18.1 25.39,26.52 25.39,29.69 v24.12,30.96 | 5.71,78.59 2.54,75.41 2.54,12.55 5.08,10.64 U$1.A1 | 27.93,22.07 31.74,22.07 | 31.74,22.07 34.92,22.07 36.19,23.34 C8.2 | IC6.8 IC6.9 IC6.10 | 85.72,77.95 84.45,79.22 IC16.8 84.45,91.29 v86.35,93.19 | 85.72,77.95 89.53,73.51 C12.2 | 85.72,77.95 84.45,76.68 v84.45,75.41 v84.45,57.63 IC14.1 86.35,51.92 86.35,32.87 IC14.10 v84.45,23.34 v84.45,18.26 83.81,17.63 83.81,8.74 80.64,5.56 IC11.7 | C9.2 106.04,69.7 106.67,70.33 106.67,84.3 108.58,86.21 IC7.7 | C5.2 IC17.19 | 137.16,92.56 IC12.7 | C20.2 v113.66,88.11 113.66,86.21 114.3,85.57 114.3,83.67 U1.1 118.74,80.49 121.28,77.95 121.28,61.44 130.17,52.55 130.17,34.14 132.07,32.23 | U$3.4 C1.2 | C16.2 137.79,45.57 144.14,51.92 C2.2 144.14,62.71 C3.2 IC4.7 147.31,70.97 147.31,73.51 IC4.12 IC4.13 155.57,81.76 | 155.57,81.76 C18.2 | 155.57,81.76 155.57,85.57 156.84,86.84 IC10.7 | IC5.10 135.25,3.02 140.33,8.1 IC5.13 | QG1.7 156.84,30.96 155.57,29.69 JP2.1 JP3.1 JP4.1 155.57,19.53 151.76,15.72 151.76,10.01 153.66,8.1 U$4.3 | v107.31,25.88 108.58,27.15 C13.2
  Bottom 0.254: 66.03,75.41 C10.2 | 44.45,22.07 v45.08,22.71 | C8.2 38.1,23.34 | 95.24,24.61 C11.2 | v84.45,18.26 IC6.2 | C2.2 144.14,54.46 | 128.27,27.79 128.27,28.42 | 133.34,32.23 U1.21 | 138.42,44.93 C16.2 | IC12.5 127.63,87.48 129.53,85.57 131.44,85.57 132.71,86.84 IC12.7
  Bottom 0.406: 66.03,75.41 65.4,76.05 50.8,76.05 47.62,72.87 44.45,72.87 43.18,74.14 IC17.10 | C11.2 96.52,24.61 97.78,25.88 IC1.1 v107.31,25.88 | v45.08,22.71 46.35,23.34 U$2.20 U$2.21 v84.45,23.34 93.97,23.34 95.24,24.61 | 38.1,23.34 39.37,22.07 44.45,22.07 | C6.2 v20.95,89.38 U$1.C32 U$1.A32 | U$1.A1 U$1.C1 C23.- | v24.12,30.96 23.49,30.96 22.22,32.23 IC15.10 | IC6.9 IC1.10 106.04,3.02 107.31,4.29 116.2,4.29 117.47,3.02 IC13.10 120.01,3.02 121.91,4.93 124.45,4.93 125.09,4.29 131.44,4.29 132.71,3.02 IC5.10 IC5.11 | 80.64,2.39 87.62,2.39 IC6.8 | 80.64,2.39 59.69,2.39 IC19.7 | IC11.7 80.64,2.39 | C5.2 55.24,94.46 56.51,93.19 C22.2 v86.35,93.19 C21.2 C20.2 C19.2 138.42,93.19 140.33,91.29 153.66,91.29 IC10.7 | v113.66,88.11 IC7.7 | 144.14,54.46 154.94,54.46 U$3.4 | C17.2 137.16,67.79 138.42,69.06 IC4.7 | 136.52,8.1 IC5.8 | 136.52,8.1 IC5.13 152.39,8.1 153.03,7.47 U$4.3 | 136.52,8.1 IC5.15 | IC13.1 120.01,25.88 121.28,24.61 127.63,24.61 128.27,25.25 128.27,27.79 111.12,27.79 109.21,29.69 C13.2 | 128.27,28.42 C14.2 130.81,28.42 132.07,29.69 137.79,29.69 138.42,29.06 139.69,29.06 142.23,31.6 | C15.2 146.04,24.61 147.95,26.52 153.66,26.52 JP2.1 153.66,30.33 149.85,30.33 148.59,31.6 142.23,31.6 | 133.34,32.23 133.98,31.6 142.23,31.6 | 138.42,44.93 144.78,38.58 QG1.7 | v33.02,97 IC17.1 | C10.2 67.94,76.68 71.11,76.68 72.38,75.41 74.29,75.41 74.92,76.05 76.19,76.05 76.83,75.41 80.64,75.41 81.91,76.05 83.81,76.05 v84.45,75.41 | v84.45,57.63 C12.2
IOINH  (via drill 0.61)
  Top 0.254: v114.93,89.38 114.93,88.11 123.19,79.86 123.19,61.44 133.34,61.44 133.98,60.81 IC5.1 | v106.04,91.29 103.5,93.83 IC7.10
  Bottom 0.254: v114.93,89.38 113.66,90.65 106.67,90.65 v106.04,91.29
MA12  (via drill 0.61)
  Top 0.254: v58.41,20.8 57.78,21.44 57.78,37.95 v58.41,38.58
  Bottom 0.254: IC18.18 34.29,20.8 34.92,20.17 38.73,20.17 39.37,20.8 v58.41,20.8 | v58.41,38.58 U$2.27
MA13  (via drill 0.61)
  Top 0.254: v15.24,14.45 17.77,16.99 17.77,25.88 17.14,26.52 17.14,27.79 17.77,28.42 17.77,37.95 15.24,40.49 v15.24,48.74 | v59.05,47.47 59.69,46.84 v59.69,36.04
  Bottom 0.254: v15.24,14.45 28.57,14.45 32.38,18.26 IC18.17 | v15.24,48.74 52.07,48.74 53.34,47.47 v59.05,47.47 | v59.69,36.04 U$2.26
MA14  (via drill 0.61)
  Top 0.254: v36.19,21.44 36.19,18.26 IC18.16 | v59.05,22.07 58.41,22.71 58.41,32.23 v59.69,33.5
  Bottom 0.254: v36.19,21.44 57.78,21.44 58.41,22.07 v59.05,22.07 | v59.69,33.5 U$2.25
MA15  (via drill 0.61)
  Top 0.254: v67.3,18.9 67.94,19.53 67.94,29.06 69.21,30.33 U$2.24
  Bottom 0.254: v67.3,18.9 38.73,18.9 36.83,16.99 32.38,16.99 31.74,16.36 31.74,15.09 IC18.15
MA16  (via drill 0.61)
  Top 0.254: v35.55,14.45 35.55,12.55 IC18.14 | v69.84,16.36 70.48,16.99 70.48,26.52 69.21,27.79 U$2.23
  Bottom 0.254: v35.55,14.45 38.73,17.63 57.78,17.63 59.05,16.36 64.13,16.36 64.77,16.99 69.21,16.99 v69.84,16.36
MA17  (via drill 0.61)
  Top 0.254: v59.05,6.2 60.32,7.47 v60.32,24.61
  Bottom 0.254: v59.05,6.2 49.53,6.2 48.26,7.47 41.27,7.47 40.64,8.1 IC18.13 | v60.32,24.61 61.59,25.88 U$2.22
MA18  (via drill 0.61)
  Top 0.254: v39.37,24.61 39.37,10.01 34.92,5.56 IC18.12
  Bottom 0.254: v39.37,24.61 40,25.25 53.97,25.25 U$2.19
MA19  (via drill 0.61)
  Top 0.254: v40.64,28.42 40.64,10.01 IC18.11
  Bottom 0.254: v40.64,28.42 U$2.18
MEMSEL  (via drill 0.61)
  Top 0.254: v46.35,8.74 47.62,9.37 IC19.12 | IC19.1 v42.54,8.74 | v130.17,22.07 130.17,11.91 127.63,9.37 122.55,9.37 v122.55,3.66
  Bottom 0.254: v42.54,8.74 v46.35,8.74 | v130.17,22.07 135.25,22.07 136.52,23.34 IC5.19 | v122.55,3.66 120.01,1.75 45.08,1.75 IC19.1
MMUMODE  (via drill 0.61)
  Top 0.254: v78.1,7.47 IC11.9 | v56.51,7.47 56.51,39.22 54.61,41.12 U$2.13
  Bottom 0.254: 61.59,7.47 61.59,6.2 62.86,4.93 64.77,4.93 IC11.1 | 61.59,7.47 65.4,7.47 66.03,6.83 77.46,6.83 v78.1,7.47 | v56.51,7.47 61.59,7.47
N$1  (via drill 0.61)
  Top 0.254: IC12.2 v123.19,91.29
  Bottom 0.254: v123.19,91.29 123.82,90.65 146.68,90.65 IC10.4
N$2
  Bottom 0.254: U$3.1 140.97,56.36 139.69,55.09 C2.1
N$3  (via drill 0.61)
  Top 0.254: v70.48,15.09 69.21,13.82 69.21,10.01 66.67,7.47 63.5,7.47 63.5,13.82 62.86,14.45 62.86,50.01 v61.59,51.28
  Bottom 0.254: v70.48,15.09 71.11,14.45 85.72,14.45 86.99,13.18 IC6.4 | v61.59,51.28 U$2.9
N$4
  Top 0.254: IC11.3 IC11.4
N$5  (via drill 0.61)
  Top 0.254: v139.69,16.99 139.69,11.28 IC5.9
  Bottom 0.254: v139.69,16.99 149.22,16.99 JP4.2
N$6
  Top 0.254: IC5.12 151.12,5.56 151.12,18.9 151.76,19.53 151.76,22.07 153.03,23.34 JP3.2
N$7  (via drill 0.61)
  Top 0.254: v146.04,15.09 148.59,17.63 148.59,25.25 149.85,26.52 152.39,26.52 152.39,27.79 JP2.2
  Bottom 0.254: IC5.14 v146.04,15.09
N$8  (via drill 0.61)
  Top 0.254: v144.14,14.45 147.95,18.26 147.95,28.42 149.85,30.33 152.39,30.33 152.39,31.6 JP1.2
  Bottom 0.254: v144.14,14.45 139.06,14.45 135.25,10.64 IC5.7
N$9
  Top 2: 20.63,-0.52 -0.37,-0.52 -0.37,20.48
N$10
  Top 2: 140.63,-0.52 161.63,-0.52 161.63,20.48
N$11
  Top 2: 20.63,101.48 -0.37,101.48 -0.37,80.48
N$12
  Top 2: 161.63,80.48 161.63,101.48 140.63,101.48
N$13
  Bottom 2: 20.63,-0.52 -0.37,-0.52 -0.37,20.48
N$14
  Bottom 2: 140.63,-0.52 161.63,-0.52 161.63,20.48
N$15
  Bottom 2: 20.63,101.48 -0.37,101.48 -0.37,80.48
N$16
  Bottom 2: 161.63,80.48 161.63,101.48 140.63,101.48
N$17
  Bottom 0.254: 149.85,58.27 144.14,58.27 142.23,60.17 R1.1 | 149.85,58.27 U$3.2 | 149.85,58.27 158.11,58.27 158.11,13.18 U$4.1
N$19
  Top 0.254: U$3.3 154.3,55.09 151.76,52.55 C1.1
N$20  (via drill 0.61)
  Top 0.254: v76.83,10.01 v76.83,38.58 | v52.07,39.85 52.7,40.49 52.7,51.92 53.97,53.19 U$2.8
  Bottom 0.254: v76.83,10.01 86.35,10.01 86.99,10.64 IC6.5 | v76.83,38.58 75.56,39.85 v52.07,39.85
N$22
  Top 0.254: IC4.9 154.94,73.51 154.94,74.78 JP5.3
N$24
  Top 0.254: IC11.2 69.84,2.39 76.83,2.39 76.83,8.74 75.56,10.01 IC11.10
N$25  (via drill 0.61)
  Top 0.254: v36.83,9.37 v38.1,13.18
  Bottom 0.254: v36.83,9.37 38.73,10.01 43.18,10.01 IC19.13 | v38.1,13.18 39.37,14.45 45.72,14.45 47.62,16.36 56.51,16.36 57.78,15.09 62.23,15.09 64.13,13.18 64.77,13.82 66.03,13.82 IC11.13
N$26  (via drill 0.7)
  Top 0.254: IC19.11 50.16,13.18 49.53,13.82 49.53,53.82 48.26,55.09 48.26,61.44 52.07,65.25 55.88,65.25 55.88,69.7 57.15,70.97 57.15,81.76 58.41,83.67 61.59,83.67 v61.59,83.03 | IC7.9 106.04,97.64 100.32,97.64 99.69,97 99.69,86.84 99.05,86.21 v99.05,83.67
  Bottom 0.254: v61.59,83.03 62.23,83.67 71.75,83.67 72.38,84.3 79.37,84.3 80,84.94 93.34,84.94 95.24,83.03 98.42,83.03 v99.05,83.67
N$58  (via drill 0.61)
  Top 0.254: v80.64,76.68 80.64,93.19 79.37,94.46 IC16.11 | v85.72,76.05 88.89,72.87 88.89,58.9 88.26,58.27 v88.26,32.23 | v99.05,22.71 v99.05,29.69
  Bottom 0.254: v85.72,76.05 85.08,76.05 84.45,76.68 v80.64,76.68 | v88.26,32.23 90.8,29.69 v99.05,29.69 | v99.05,22.71 102.23,19.53 104.77,19.53 107.31,22.07 108.58,22.07 109.85,23.34 IC1.19
N$64  (via drill 0.61)
  Top 0.254: IC15.11 30.47,34.14 30.47,35.41 IC15.13 | v24.76,42.39 25.39,41.76 v25.39,37.31
  Bottom 0.254: v24.76,42.39 IC15.6 | v25.39,37.31 IC15.13 29.84,37.31 32.38,39.85 JP6.2
N$65  (via drill 0.61)
  Top 0.254: v40.64,53.82 40.64,72.87 41.27,73.51 41.27,84.94 v44.45,88.11
  Bottom 0.254: v40.64,53.82 38.1,51.28 31.11,51.28 29.84,52.55 IC15.19 | v44.45,88.11 IC16.1
N$66  (via drill 0.61)
  Top 0.254: v132.71,28.42 132.07,29.06 132.07,29.69 128.9,32.87 128.9,36.68 126.99,38.58 126.99,52.55 120.01,60.81 120.01,77.32 118.1,79.22 113.02,79.22 113.02,82.4 111.75,83.67 111.75,95.1 108.58,98.27 90.8,98.27 v90.8,94.46
  Bottom 0.254: v132.71,28.42 132.07,28.42 130.81,27.15 128.9,27.15 128.9,24.61 127.63,23.34 IC13.19 | v90.8,94.46 87.62,94.46 86.35,95.73 IC16.9
N$68  (via drill 0.61)
  Top 0.254: v70.48,86.21 70.48,93.19 69.21,94.46 IC16.15
  Bottom 0.254: v70.48,86.21 74.92,86.21 IC16.5
N$69  (via drill 0.61)
  Top 0.254: v78.73,76.68 78.73,77.95 78.1,78.59 78.1,93.19 76.83,94.46 IC16.12 | v88.89,76.05 90.8,74.14 90.8,55.09 88.89,53.19 88.89,33.5 89.53,32.87 89.53,23.98 93.97,19.53 93.97,11.28 IC6.7
  Bottom 0.254: v78.73,76.68 80,77.95 86.99,77.95 v88.89,76.05
N$72  (via drill 0.61)
  Top 0.254: v73.02,8.74 71.75,10.01 v71.75,21.44 | v61.59,22.07 61.59,50.01 60.32,51.28 v60.32,55.73
  Bottom 0.254: v73.02,8.74 78.1,8.74 78.73,8.1 IC6.6 | v71.75,21.44 71.11,22.07 v61.59,22.07 | v60.32,55.73 59.69,56.36 U$2.7
NOEXEC
  Top 0.254: IC19.4 50.16,5.56 51.43,6.83 51.43,37.95 53.34,39.85 54.61,39.85 55.24,39.22 55.24,35.41 53.97,34.14 U$2.16
NOEXECERR  (via drill 0.61)
  Top 0.254: v69.21,8.74 70.48,10.01 IC11.12 | v55.24,7.47 IC19.6 | v48.26,29.69 48.89,29.06 v48.89,8.74
  Bottom 0.254: 56.51,8.74 v55.24,7.47 | 56.51,8.74 65.4,8.74 66.67,7.47 67.94,7.47 v69.21,8.74 | v48.26,29.69 40.64,29.69 40,29.06 36.19,29.06 35.55,29.69 10.16,29.69 6.34,33.5 U$1.A10 | v48.89,8.74 56.51,8.74
NOTMAPPED
  Bottom 0.254: U$1.A11 6.34,36.04 7.62,37.31 14.6,37.31 15.87,36.04 U$2.15
PHI0
  Bottom 0.254: IC17.15 53.34,84.3 53.97,84.94 70.48,84.94 71.11,85.57 75.56,85.57 76.19,86.21 95.88,86.21 97.15,84.94 106.67,84.94 107.94,86.21 115.56,86.21 116.83,84.94 126.36,84.94 132.07,79.22 133.34,79.22 133.98,78.59 133.98,73.51 132.71,73.51 U1.37 147.95,72.87 151.76,69.06 IC4.8
PHI1  (via drill 0.61)
  Top 0.254: v50.16,79.22 47.62,81.76 IC17.14
  Bottom 0.254: v50.16,79.22 50.8,78.59 73.02,78.59 73.66,77.95 78.73,77.95 79.37,78.59 89.53,78.59 90.16,79.22 105.41,79.22 107.94,76.68 115.56,76.68 116.83,75.41 U1.3
PHI2  (via drill 0.61)
  Top 0.254: IC10.1 141.6,86.21 133.34,77.95 U1.39 | IC17.11 IC17.12 IC17.13 44.45,81.13 44.45,82.4 45.08,83.03 50.16,83.03 v50.16,86.21 | v64.77,86.84 67.94,83.67 v67.94,79.86
  Bottom 0.254: 125.09,86.21 119.38,86.21 IC12.1 | 125.09,86.21 127.63,86.21 129.53,84.3 137.79,84.3 IC10.1 | v50.16,86.21 61.59,86.21 62.23,86.84 v64.77,86.84 | v67.94,79.86 68.57,79.86 69.21,79.22 73.66,79.22 74.29,78.59 78.1,78.59 78.73,79.22 88.89,79.22 89.53,79.86 107.94,79.86 109.85,81.76 126.99,81.76 130.81,77.95 U1.39 | 125.09,86.21 IC12.4
PR/-W  (via drill 0.61)
  Top 0.254: v31.74,65.25 v31.74,80.49 | IC7.5 103.5,70.97 102.23,69.7 102.23,65.25 IC2.1
  Bottom 0.254: v31.74,65.25 59.05,65.25 60.96,63.35 66.67,63.35 68.57,65.25 74.29,65.25 74.92,64.62 102.86,64.62 IC2.1 104.77,65.25 106.04,66.52 130.81,66.52 132.07,65.25 U1.34 | v31.74,80.49 IC3.18
PW/-R  (via drill 0.61)
  Top 0.254: v59.69,32.23 60.96,33.5 60.96,49.38 59.05,51.28 v59.05,58.9 | v71.11,57.63 73.02,59.54 v73.02,69.06 | v95.24,70.97 97.15,72.87 v97.15,86.21 | IC19.9 v55.24,29.69
  Bottom 0.254: v55.24,29.69 57.78,32.23 v59.69,32.23 | v59.05,58.9 67.3,58.9 68.57,57.63 v71.11,57.63 | v73.02,69.06 75.56,71.6 94.61,71.6 v95.24,70.97 | v97.15,86.21 104.13,86.21 IC7.6
RDY  (via drill 0.61)
  Top 0.254: v34.92,83.03 34.92,98.27 12.7,98.27 8.25,93.83 8.25,77.32 5.71,74.78 U$1.A26 | v42.54,84.3 v42.54,81.76 | v56.51,83.03 57.78,84.3 63.5,84.3 64.13,83.67 v64.13,80.49 | v111.12,83.03 RN1.5
  Bottom 0.254: RN1.5 112.39,80.49 114.93,77.95 U1.2 | v34.92,83.03 41.27,83.03 v42.54,84.3 | v42.54,81.76 43.81,83.03 v56.51,83.03 | v64.13,80.49 64.77,80.49 65.4,81.13 69.21,81.13 70.48,79.86 74.29,79.86 74.92,79.22 77.46,79.22 78.1,79.86 88.26,79.86 88.89,80.49 107.31,80.49 109.85,83.03 v111.12,83.03
RES  (via drill 0.61)
  Top 0.254: IC11.8 80.64,13.18 81.27,13.82 v81.27,16.36 81.27,16.99 79.37,18.9 79.37,34.77 80,35.41 80,43.66 78.73,44.93 78.73,71.6 v81.91,74.78 | v100.32,74.78 100.32,86.21 100.96,86.84 IC7.4
  Bottom 0.254: v81.27,16.36 81.91,16.99 93.34,16.99 94.61,18.26 IC6.15 | v81.91,74.78 82.55,74.78 83.18,74.14 91.44,74.14 92.07,74.78 v100.32,74.78
SYNC  (via drill 0.61)
  Top 0.254: IC19.5 50.8,2.39 43.81,2.39 43.81,23.98 42.54,25.25 42.54,54.46 41.91,55.09 v41.91,72.24 41.91,76.68 v43.18,77.95 | v118.74,69.06 118.74,67.16 117.47,65.89 U1.7 | v75.56,70.33 74.29,71.6 74.29,76.05 v73.02,77.32
  Bottom 0.254: v41.91,72.24 31.74,72.24 31.11,72.87 IC3.15 | v118.74,69.06 107.94,69.06 106.67,67.79 89.53,67.79 86.99,70.33 v75.56,70.33 | v43.18,77.95 72.38,77.95 v73.02,77.32
VCC  (via drill 0.61, 0.7)
  Top 0.254: C4.1 42.54,16.36 | 142.23,45.57 142.23,46.2 | 141.6,46.84 QG1.14
  Top 0.406: IC19.14 C4.1 | IC11.14 C24.1 65.4,29.69 68.57,32.23 72.38,32.23 v72.38,25.88 | IC18.20 35.55,27.79 35.55,40.49 JP6.3 | U$1.C2 U$1.C3 13.97,15.72 16.5,18.26 v16.5,37.31 | RN3.1 18.41,11.91 C23.+ 19.04,15.09 19.04,25.88 19.68,26.52 19.68,30.96 19.04,31.6 19.04,35.41 IC15.8 22.86,39.22 22.86,45.57 IC15.4 IC15.3 IC15.2 | C6.1 IC3.20 30.47,83.67 30.47,63.98 | 30.47,55.09 IC15.20 30.47,53.19 30.47,49.38 | 30.47,55.09 C7.1 | IC15.17 30.47,49.38 | 30.47,55.09 30.47,63.98 | 30.47,49.38 30.47,44.3 IC15.15 | 42.54,16.36 41.91,16.99 41.91,28.42 41.27,29.69 37.46,29.69 C8.1 | C11.1 93.34,23.98 95.24,22.07 95.24,21.44 IC6.16 | IC1.20 C13.1 | IC13.20 C14.1 v130.17,23.34 128.9,22.71 v128.9,16.99 | QG1.1 QG1.14 142.23,46.2 | 149.22,38.58 142.23,45.57 | 149.22,38.58 JP1.1 | 149.22,38.58 149.22,31.6 145.41,27.79 C15.1 | IC5.17 143.5,20.17 143.5,23.98 IC5.20 | U$2.40 C10.1 69.21,85.57 67.94,86.84 67.94,93.19 66.67,94.46 IC16.16 | C5.1 IC17.20 44.45,97 41.91,94.46 v41.91,87.48 | 92.07,69.06 v92.07,61.44 C12.1 IC14.20 90.8,53.82 90.16,53.19 90.16,27.15 90.8,26.52 v90.8,24.61 | 92.07,69.06 v92.07,82.4 92.07,93.19 93.34,94.46 IC7.14 | RN1.1 IC2.20 | 153.03,90.02 153.03,93.19 154.3,94.46 IC10.9 | 153.03,90.02 IC4.14 | U$3.8 U$3.7 | C17.1 R1.2 R2.2 141.6,74.78 143.5,76.68 143.5,87.48 IC10.2 144.14,89.38 143.5,90.02 | IC12.14 C20.1 112.39,94.46 112.39,85.57 v113.02,84.94 | C19.1 IC10.14 141.6,91.92 143.5,90.02 | 143.5,90.02 153.03,90.02 | 92.07,69.06 v92.7,69.06 | v75.56,74.78 76.83,73.51 76.83,62.08 v76.19,61.44 | 141.6,46.84 145.41,50.65 C3.1 | v55.88,71.6 55.88,70.97 55.24,70.33 53.34,70.33 v50.16,67.16
  Top 0.406: 30.47,63.98 32.38,63.98 33.65,65.25 v33.65,67.16
  Bottom 0.254: C4.1 43.18,15.72 | C11.1 93.97,24.61 | 137.16,95.73 C19.1 | U1.8 118.1,62.71 | 144.78,61.44 C3.1
  Bottom 0.406: 43.18,15.72 44.45,16.99 57.15,16.99 58.41,15.72 C24.1 | IC18.20 C8.1 | IC15.15 JP6.3 | U$1.C2 C23.+ | IC15.4 IC15.17 | v130.17,23.34 IC5.2 | 113.66,27.15 112.39,25.88 IC1.20 | 113.66,27.15 123.82,27.15 125.09,25.88 IC13.20 | 93.97,24.61 96.52,27.15 113.66,27.15 | IC5.6 132.71,13.18 131.44,11.91 125.09,11.91 124.45,12.55 124.45,16.99 v128.9,16.99 131.44,16.99 132.71,18.26 IC5.4 IC5.17 | IC5.20 142.87,25.88 144.14,27.15 C15.1 | C16.1 138.42,47.47 139.69,46.2 QG1.14 | IC16.16 C22.1 52.07,95.73 50.8,97 C5.1 | IC7.14 C21.1 | RN1.1 105.41,70.33 104.13,69.06 C9.1 v92.7,69.06 | U1.8 116.83,62.71 114.3,65.25 IC2.20 | IC4.14 C18.1 | C3.1 146.04,61.44 147.95,63.35 148.59,63.35 U$3.8 149.22,70.33 R1.2 | 137.16,95.73 135.25,97.64 119.38,97.64 IC12.14 | 118.1,62.71 119.38,63.98 134.62,63.98 | 134.62,63.98 142.23,63.98 144.78,61.44 | v75.56,74.78 70.48,74.78 69.84,75.41 C10.1 | v76.19,61.44 76.83,60.81 86.35,60.81 86.99,61.44 v92.07,61.44 | v72.38,25.88 73.66,24.61 v90.8,24.61 C11.1 | RN3.1 20.31,5.56 21.58,6.83 29.2,6.83 31.74,9.37 34.92,9.37 36.19,10.64 40,10.64 41.27,11.91 IC19.14 | v16.5,37.31 IC15.8 | IC3.20 41.27,85.57 41.91,86.21 v41.91,87.48 | v92.07,82.4 93.34,82.4 93.97,81.76 100.32,81.76 101.59,83.03 103.5,83.03 104.77,81.76 106.67,81.76 109.85,84.94 v113.02,84.94 | v55.88,71.6 U$2.40 | v33.65,67.16 34.29,67.16 34.92,66.52 49.53,66.52 v50.16,67.16 | 134.62,63.98 134.62,68.43 C17.1
WPROT
  Top 0.254: IC19.10 52.7,13.18 52.07,13.82 52.07,36.04 53.97,37.95 U$2.14
WPROTERR  (via drill 0.61)
  Top 0.254: v17.77,39.22 18.41,38.58 v18.41,27.15 | v44.45,26.52 46.35,24.61 v46.35,10.01
  Bottom 0.254: IC11.11 71.11,10.01 64.77,10.01 63.5,11.28 58.41,11.28 IC19.8 55.88,10.01 v46.35,10.01 | v17.77,39.22 15.87,39.85 7.62,39.85 6.34,38.58 U$1.A12 | v18.41,27.15 38.73,27.15 39.37,26.52 v44.45,26.52

## Text on the board
Top: CSACPU-V2.0J | (C) A. Fachat